# Altium schematic sheet ISO_CAN.SchDoc
size C; SheetNumber: 6; SheetTotal: 6
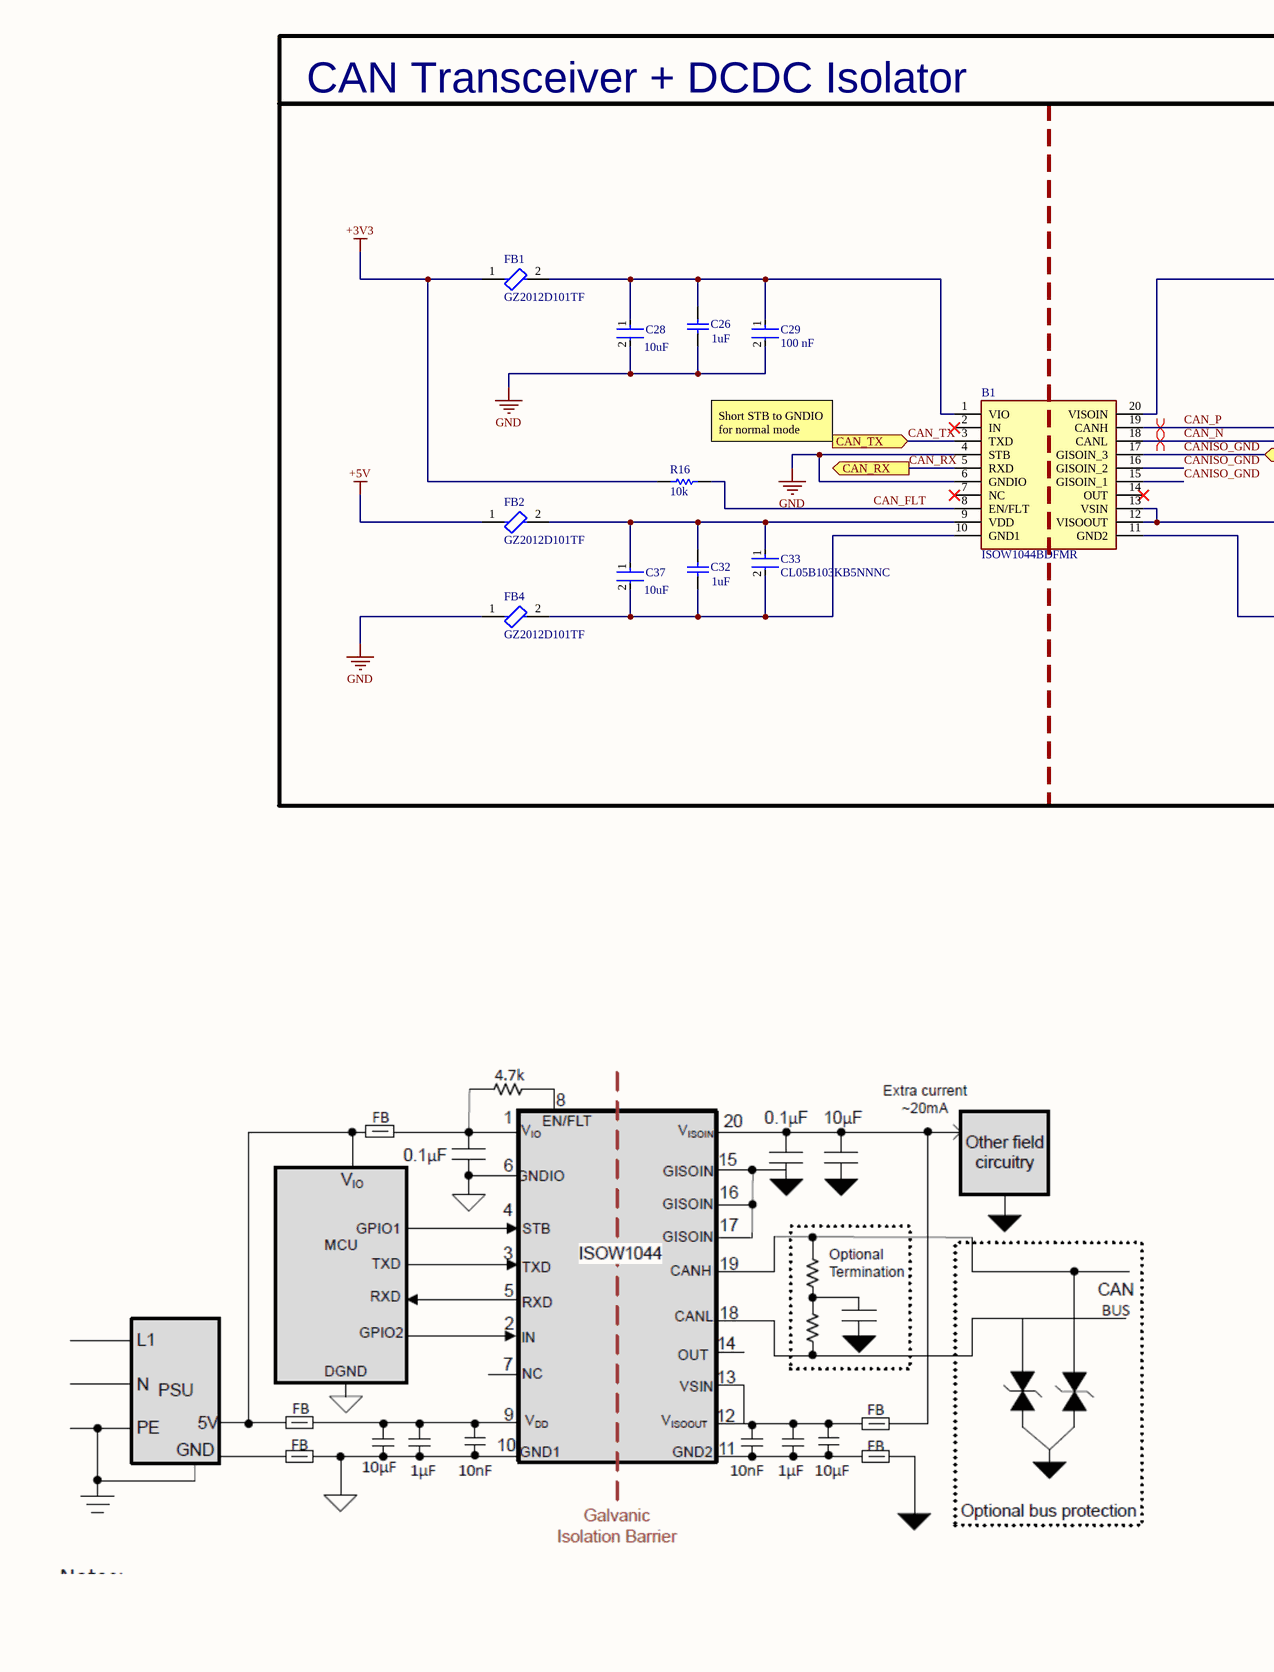
[diagram p0: ISO_CAN.SchDoc, top left]
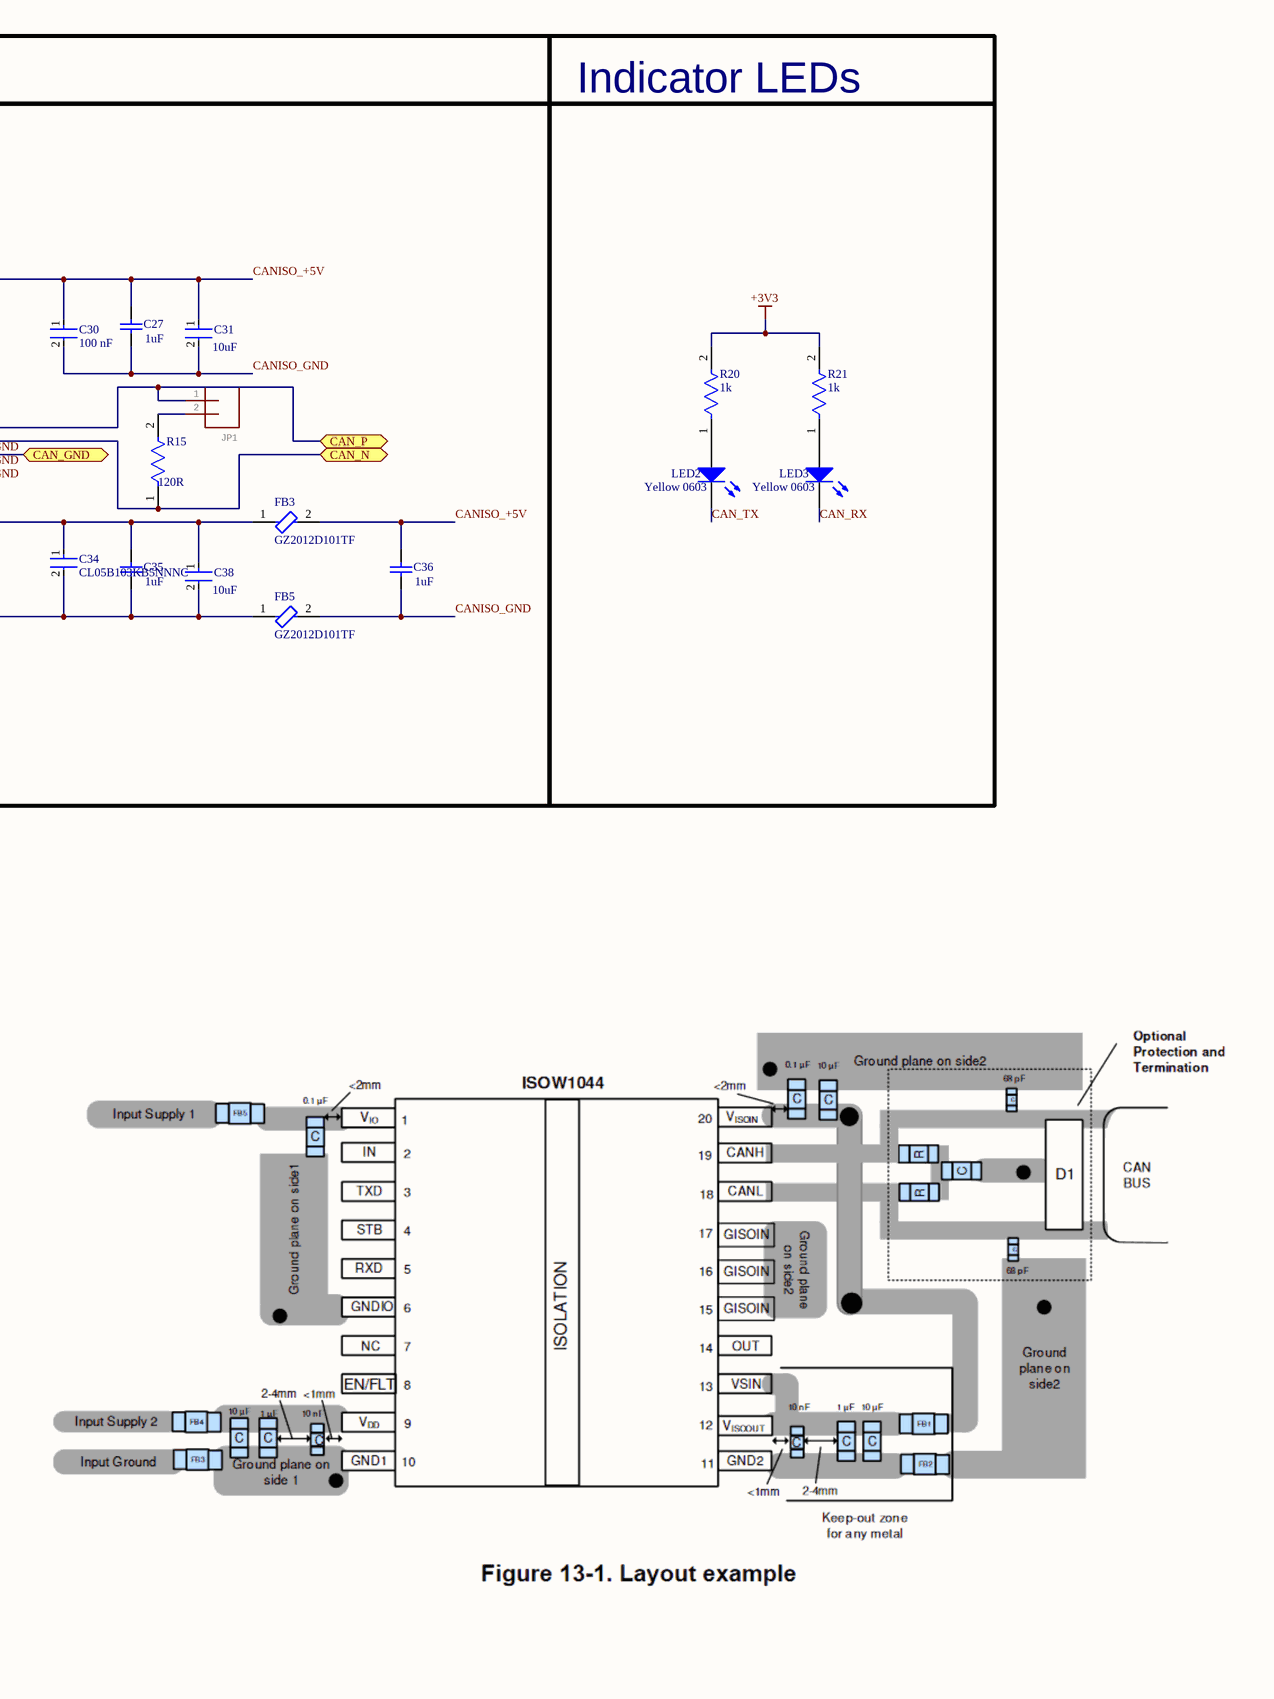
[diagram p1: ISO_CAN.SchDoc, top right]
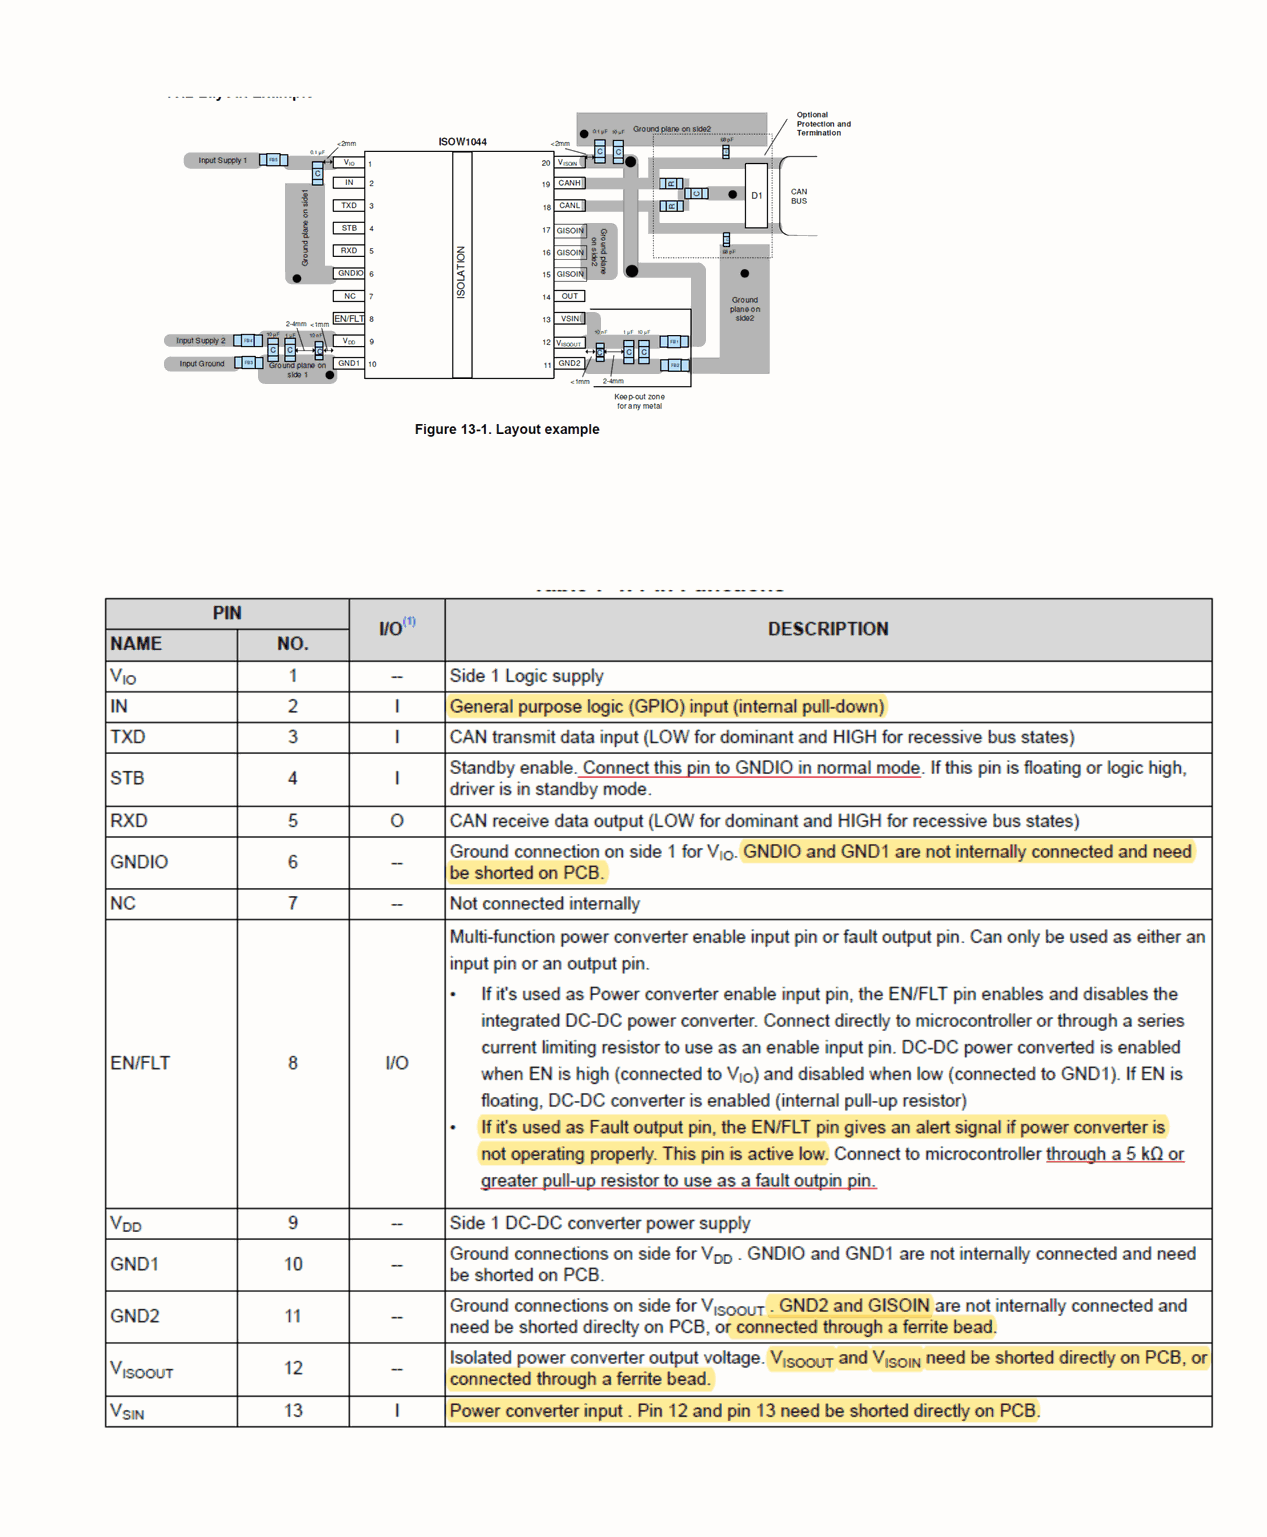
[diagram p2: ISO_CAN.SchDoc, bottom left]
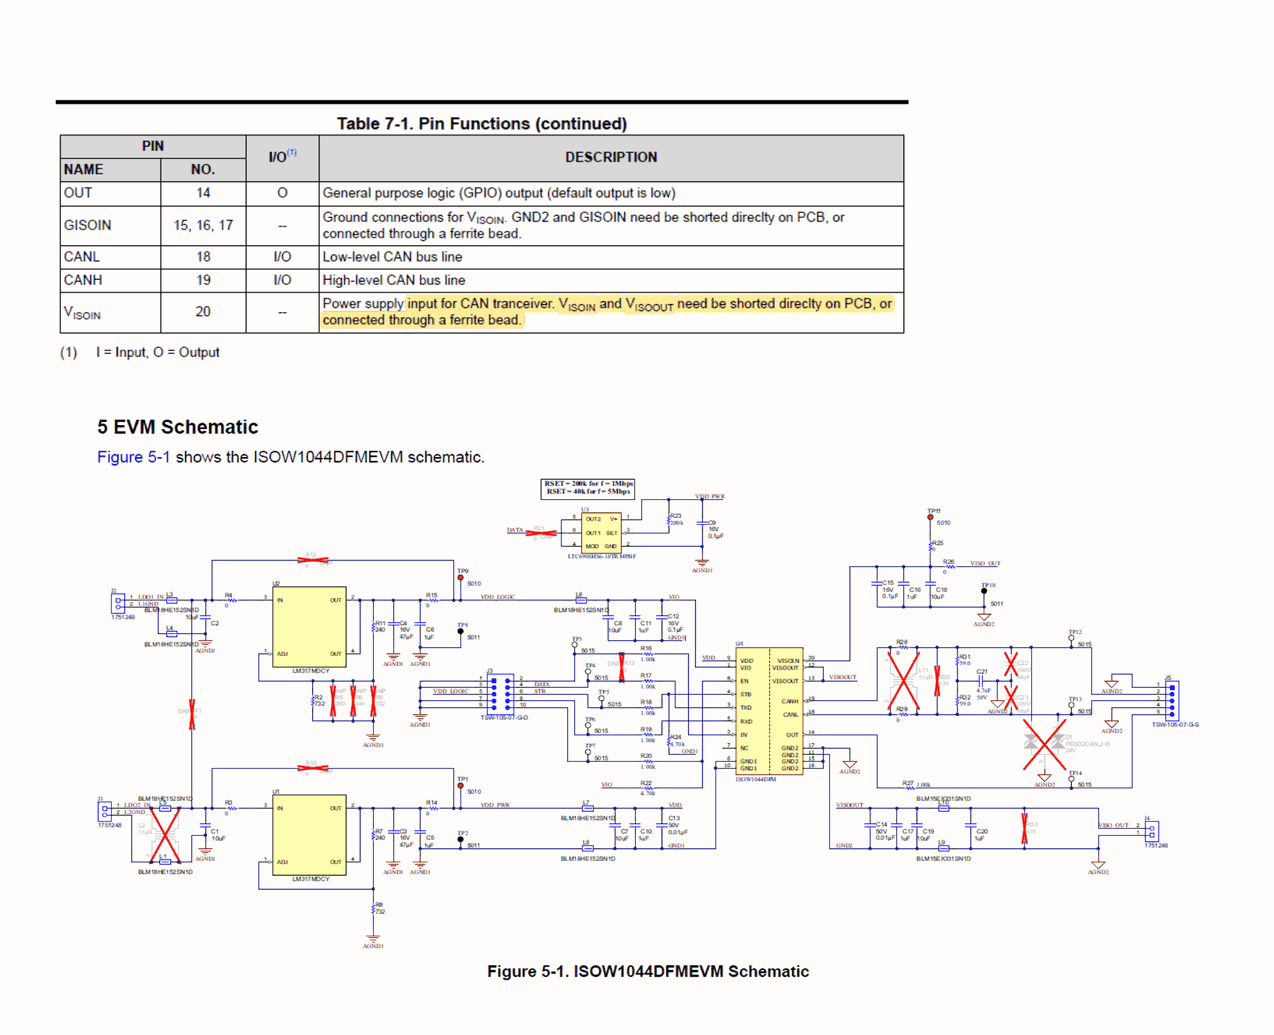
[diagram p3: ISO_CAN.SchDoc, bottom right]

## Parts
B1  ISOW1044BDFMR  [SOIC127P1030X355-20N]
C26  value 1uF  [CAPC1608X95N]  (hidden comment: 1uF 0603)
C27  value 1uF  [CAPC1608X95N]  (hidden comment: 1uF 0603)
C28  Capacitance: 10uF  [FP-GRM21B-0_2-e0_2_0_7-IPC_A]  (hidden comment: GRM21BR61H106KE43L)
C29  Capacitance: 100 nF  [FP-CC0603-DA-MFG]  (hidden comment: CC0603KRX7R9BB104)
C30  Capacitance: 100 nF  [FP-CC0603-DA-MFG]  (hidden comment: CC0603KRX7R9BB104)
C31  Capacitance: 10uF  [FP-GRM21B-0_2-e0_2_0_7-IPC_A]  (hidden comment: GRM21BR61H106KE43L)
C32  value 1uF  [CAPC1608X95N]  (hidden comment: 1uF 0603)
C33  CL05B103KB5NNNC  [FP-CL165-IPC_C]
C34  CL05B103KB5NNNC  [FP-CL165-IPC_C]
C35  value 1uF  [CAPC1608X95N]  (hidden comment: 1uF 0603)
C36  value 1uF  [CAPC1608X95N]  (hidden comment: 1uF 0603)
C37  Capacitance: 10uF  [FP-GRM21B-0_2-e0_2_0_7-IPC_A]  (hidden comment: GRM21BR61H106KE43L)
C38  Capacitance: 10uF  [FP-GRM21B-0_2-e0_2_0_7-IPC_A]  (hidden comment: GRM21BR61H106KE43L)
FB1  GZ2012D101TF  [FP-BLM21-0_2-t0_85-e0_5-IPC_A]
FB2  GZ2012D101TF  [FP-BLM21-0_2-t0_85-e0_5-IPC_A]
FB3  GZ2012D101TF  [FP-BLM21-0_2-t0_85-e0_5-IPC_A]
FB4  GZ2012D101TF  [FP-BLM21-0_2-t0_85-e0_5-IPC_A]
FB5  GZ2012D101TF  [FP-BLM21-0_2-t0_85-e0_5-IPC_A]
JP1  Multi connection point. Often used as Generic Header-pin footprint for 0.1 inch spaced/style header connections    On any of the 0.1 inch spaced packages, you can populate with these:  Break Away Headers - Straight (PRT-00116)   Break Away Male Headers - Right Angle (PRT-00553)   Female Headers (PRT-00115)   Break Away Headers - Machine Pin (PRT-00117)   Break Away Female Headers - Swiss Machine Pin (PRT-00743)        For SCREWTERMINALS and SPRING TERMINALS visit here:  Screw Terimnals on SparkFun.com (5mm/3.5mm/2.54mm spacing)       This device is also useful as a general connection point to wire up your design to another part of your project. Our various solder wires solder well into these plated through hole pads.  Hook-Up Wire - Assortment (Stranded, 22 AWG) (PRT-11375)   Hook-Up Wire - Assortment (Solid Core, 22 AWG) (PRT-11367)   View the entire wire category on our website here          Special notes: Molex polarized connector foot print use with: PRT-08233 with associated crimp pins and housings.  2.54_SCREWTERM for use with  PRT-10571.  3.5mm Screw Terminal footprints for  PRT-08084  5mm Screw Terminal footprints for use with PRT-08432  [1X02_LOCK]  (value not drawn)
LED2  Yellow 0603  [0603_A]
LED3  Yellow 0603  [0603_A]
R15  Resistance: 120R  [FP-CRCW0603-e3-MFG]  (hidden comment: 0603WAF1200T5E)
R16  Resistance: 10k  [RESC1609X50X30NL8T20]  (hidden comment: 0603WAF1002T5E)
R20  1k  [FP-RC0603-0_55-IPC_C]
R21  1k  [FP-RC0603-0_55-IPC_C]

## Blocks framed on the sheet
CAN Transceiver + DCDC Isolator: B1 C26-C38 FB1-FB5 JP1 R15 R16
Indicator LEDs: LED2 LED3 R20 R21

## Ports
CAN_GND (bidir, see Actuation[2A]), CAN_N (bidir, see Actuation[2A]), CAN_P (bidir, see Actuation[2A]), CAN_RX (out, see Actuation[2A]), CAN_TX (in, see Actuation[2A])

## Nets
+3V3: FB1.1 R16.1 R20.2 R21.2
+5V: FB2.1
GND: B1.4(STB) B1.6(GNDIO) C26.1 C28.2 C29.2 FB4.1
CAN_FLT: B1.8(EN/FLT) R16.2
CAN_N: B1.18(CANL) R15.1 ; port CAN_N
CAN_P: B1.19(CANH) JP1.1 ; port CAN_P
CAN_RX: B1.5(RXD) LED3.1(K) ; port CAN_RX
CAN_TX: B1.3(TXD) LED2.1(K) ; port CAN_TX
CANISO_+5V: B1.20(VISOIN) C27.2 C30.1 C31.1 C36.2 FB3.2
CANISO_GND: B1.15(GISOIN_1) B1.16(GISOIN_2) B1.17(GISOIN_3) C27.1 C30.2 C31.2 C36.1 FB5.2 ; port CAN_GND
NetB1_1: B1.1(VIO) C26.2 C28.1 C29.1 FB1.2
NetB1_9: B1.9(VDD) C32.2 C33.1 C37.1 FB2.2
NetB1_10: B1.10(GND1) C32.1 C33.2 C37.2 FB4.2
NetB1_11: B1.11(GND2) C34.2 C35.1 C38.2 FB5.1
NetB1_12: B1.12(VISOOUT) B1.13(VSIN) C34.1 C35.2 C38.1 FB3.1
NetJP1_2: JP1.2 R15.2
NetLED2_2: LED2.2(A) R20.1
NetLED3_2: LED3.2(A) R21.1

Not connected (* = marked no-connect by the designer): B1 2(IN)* 7(NC)* 14(OUT)*

## Layout directives
differential pair: CAN_N, CAN_P

## Notes on the sheet
- Short STB to GNDIO for normal mode

## Library data of the parts
B1 = CMP-194-000000-2: Texas Instruments; Geometry.Height: 3.55mm; Mouser Price/Stock: https://www.mouser.co.uk/ProductDetail/Texas-Instruments/ISOW1044BDFMR?qs=Li%252BoUPsLEnsRP1xV2fQwnw%3D%3D; Source: ISOW1044BDFMR.SchLib; Manufacturer_Part_Number: ISOW1044BDFMR; Design Item ID: ISOW1044BDFMR; Manufacturer_Name: Texas Instruments; Datasheet Link: https://www.ti.com/lit/ds/symlink/isow1044.pdf?ts=1645295421849&ref_url=https%253A%252F%252Fwww.google.com%252F; Mouser Part Number: 595-ISOW1044BDFMR
C26 C27 C32 C35 C36 = CMP-00099-1: 1uF 0603, Ceramic Capacitor, Multilayer, Ceramic, 50V, 10% +Tol, 10% -Tol, X5R, 15% TC, 1uF, Surface Mount, 0603; Multilayer: Yes; Capacitor Type: Ceramic; Height: 0.9mm; Package Shape: Rectangular; JESD-609 Code: e3; Terminal Finish: Nickel; Length: 1.6mm; Package Style: SMTMeter; RoHS Compliant: Yes; Mounting Technology: Surface Mount; Case/Package: 0603; Rated DC Voltage (URdc): 50V; Pins: 2; Min Operating Temperature: -55°C; Max Operating Temperature: 85°C; Dielectric Material: Ceramic; Width: 0.8mm; Termination: Wraparound; Packaging: Tape and Reel; Tolerance (fill in as +-): 10%; Tolerance  (fill in as +-): 10%; Reach SVHC Compliant: Yes; Temperature Characteristics Code: X5R
C28 C31 C37 C38 = CMP-06035-004402-1: Chip Multilayer Ceramic Capacitors for General Purpose, 0805, 10uF, X5R, 15%, 10%, 50V; Voltage Rating (DC): 50V; Dielectric: X5R; Tolerance: 10%; Thickness: 1.25mm; Length: 2mm; Width: 1.25mm
C29 C30 = CMP-2100-03601-2: CAP CER 0.1UF 50V X7R 0603; Manufacturer: YAGEO; Material: Ceramic; Temperature Coefficient: 15%; Tolerance: 0.1; Value: 100 nF; Height: 0.9mm; Voltage: 50 V; ComponentLink2Description: Datasheet; Device Class L2: Capacitors; Temperature Range High: +125°C; Category: Cap; Footprint Url: http://www.yageo.com/exep/pages/download/literatures/UPY-C_GEN_24.pdf; ComponentLink2URL: http://www.yageo.com/documents/recent/UPY-GPHC_X7R_6.3V-to-50V_18.pdf; Package: CC0603-DA; Temperature: -55°C to +125°C; Voltage Rating: 50 V; Temperature Characteristic: X7R; Device Class L1: Passive Components; Temperature Range Low: -55°C; Manufacturer Part Number: CC0603KRX7R9BB104; RoHS: TRUE; Automotive: No; Device Class L3: Ceramic Capacitors; Octopart: https://octopart.com/cc0603krx7r9bb104-yageo-42244635; Mouser Description: Multilayer Ceramic Capacitor, CC Series, 0.1 - F, - 10%, X7R, 50 V, 0603 [1608 Metric]; Lead Free: Yes; Digikey Description: CAP CER 0.1UF 50V X7R 0603
C33 C34 = CMP-13271-000387-1: Cap Ceramic 10nF 50V X7R ±10% SMD 0402 +125°C Paper T/R; Depth: 0.5mm; Length: 1mm; Lead Free: Lead Free; Case Code (Metric): 1005; Width: 0.02inch; Min Operating Temperature: -55°C; Thickness: 0.022inch; Package Quantity: 1; Mount: Surface Mount; Height: 0.5mm; Voltage: 50V; Material: Ceramic; Tolerance: 10%; Case Code (Imperial): 0402; Radiation Hardening: No; Case/Package: 0402; Max Operating Temperature: 125°C; Voltage Rating (DC): 50V; Contact Plating: Tin; Packaging: Tape and Reel; Voltage Rating: 50V; Capacitance: 10nF; Dielectric: X7R
FB1-FB5 = CMP-0686-00716-3: ±25% 100Ω@100MHz 0805 Ferrite Beads ROHS; Number of Lines: 1; Test Frequency: 100MHz; Impedance: 100R; Width: 1.25mm; Number of Circuits: 1; Height: 0.85mm; Min Operating Temperature: -55°C; Termination: SMD/SMT; Core Material: Ferrite; Number of Pins: 2; Case/Package: 0805; Case Code (Imperial): 0805; Frequency: 100MHz; Depth: 1.25mm; Length: 2mm; Case Code (Metric): 2012
JP1 = CONN_02LOCK: GateName_1: J1; DeviceName: LOCK; SymbolName_1: CONN_02; LibraryName: SparkFun-Connectors; DeviceSetName: CONN_02; Package: 1X02_LOCK
LED2 LED3 = CMP-00009-2: Led, Yellow, 590 Nm, 2 V, 30 Ma, 120 Mcd Rohs Compliant: Yes; Manufacturer Part No.: 150060YS75000; Test Current: 20mA; Dominant Wavelength: 590nm; Forward Current: 30mA; Viewing Angle: 140°; Lens Style: Clear,Rectangular; Forward Voltage: 2V; Luminous Intensity: 120mcd; Package Quantity: 1; Width: 0.8mm; Reach SVHC Compliant: Unknown; RoHS Compliant: Yes; Packaging: Cut Tape; Case Code (Imperial): 0603; Color: Yellow; Max Operating Temperature: 85°C; Case Code (Metric): 1608; Wavelength: 590nm; Series: WL-SMCW; Min Operating Temperature: -40°C; Case/Package: 0603; Height: 0.7mm; Length: 1.6mm; Mounting Technology: Surface Mount
R15 = CMP-1666-00020-3: 100mW Thick Film Resistors 75V ±100ppm/℃ ±1% 120Ω 0603 Chip Resistor - Surface Mount ROHS; Temperature Coefficient: 100ppm/°C; RoHS Compliant: Yes; Lead Free: Lead Free; Termination: SMD/SMT; Radiation Hardening: No; Case Code (Imperial): 0603; Series: CRCW; Resistance Tolerance: 1%; Number of Terminations: 2; Tolerance: 1%; Max Operating Temperature: 155°C; Power Rating: 100mW; Contact Plating: Tin; Package Quantity: 10; Max Power Dissipation: 100mW; Case Code (Metric): 1608; Weight: 7.1E-05oz; Packaging: Tape and Reel; Working Voltage: 75V; Mount: Surface Mount; Military Standard: Not; Construction: Rectangular; Features: Automotive AEC-Q200; Depth: 0.85mm; Min Operating Temperature: -55°C; Case/Package: 0603; Height: 0.45mm; Voltage Rating (DC): 75V; Width: 0.033inch; Technology: THICK FILM; Length: 1.55mm; Voltage Rating: 75V; Resistor Type: Thick Film
R16 = CMP-1666-00005-4: 100mW Thick Film Resistors 75V ±100ppm/℃ ±1% 10kΩ 0603 Chip Resistor - Surface Mount ROHS; Max Operating Temperature: 155 degC; Voltage Rating: 75 V; PackageDescription: 2-Pin Surface Mount Device, Body 1.575 x 0.85 mm; ComponentLink1Description: Manufacturer URL; RoHSCompliant: true; PackageReference: 0603; REACH SVHC: Unknown; Length: 1.55 mm; Packaging: Tape and Reel; Min Operating Temperature: -55 degC; Mounting Technology: Surface Mount; ComponentLink2URL: https://datasheet.ciiva.com/11809/0900766b80d98afc-11809037.pdf; Height: 0.45 mm; ComponentLink2Description: Datasheet; Package Quantity: 5000; ComponentLink1URL: http://www.vishay.com/
R20 R21 = CMP-1659-00009-5: RC0603FR-071KL. RES 1K OHM 1% 1/10W 0603; Resistance: 1kR; Voltage Rating: 50V; Power Rating: 100mW; Temperature Coefficient: 100ppm/°C; Military Standard: Not; REACH SVHC: No SVHC; Size Code: 0603; Features: Moisture Resistant; Number of Terminations: 2; Technology: THICK FILM; Series: RC; Case Code (Metric): 1608; Resistance Tolerance: 1%; Resistor Type: Thick Film; Termination: SMD/SMT; Contact Plating: Tin; Radiation Hardening: No; Min Operating Temperature: -55°C; Max Operating Temperature: 155°C; Packaging: Tape and Reel; Max Power Dissipation: 100mW; RoHS Compliant: Yes; Height: 0.45mm; Lead Free: Lead Free; Case/Package: 0603; Length: 1.6mm; Tolerance: 1%; Case Code (Imperial): 0603; Construction: Rectangular; Depth: 0.8mm